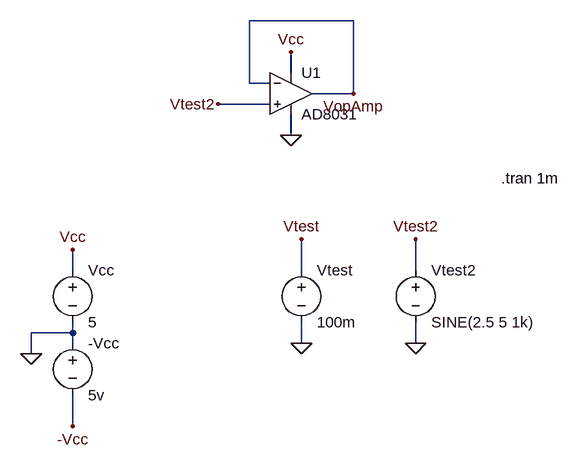
[diagram p0: schematic test_RROpAmp.asc]
test_RROpAmp.asc, the LTspice schematic file:
Version 4
SHEET 1 880 680
WIRE 448 -144 288 -144
WIRE 352 -64 352 -96
WIRE 288 -48 288 -144
WIRE 320 -48 288 -48
WIRE 448 -32 448 -144
WIRE 448 -32 384 -32
WIRE 320 -16 240 -16
WIRE 352 32 352 0
WIRE 16 240 16 208
WIRE 368 240 368 192
WIRE 544 240 544 192
WIRE 16 336 16 320
WIRE 16 336 -48 336
WIRE 16 352 16 336
WIRE 368 352 368 320
WIRE 544 352 544 320
WIRE -48 368 -48 336
WIRE 16 480 16 432
FLAG 16 208 Vcc
FLAG 16 480 -Vcc
FLAG -48 368 0
FLAG 368 352 0
FLAG 544 352 0
FLAG 368 192 Vtest
FLAG 544 192 Vtest2
FLAG 352 -96 Vcc
FLAG 352 32 0
FLAG 448 -32 VopAmp
FLAG 240 -16 Vtest2
SYMBOL voltage 16 224 R0
WINDOW 123 0 0 Left 0
WINDOW 39 0 0 Left 0
SYMATTR InstName Vcc
SYMATTR Value 5
SYMBOL voltage 16 336 R0
WINDOW 123 0 0 Left 0
WINDOW 39 0 0 Left 0
SYMATTR InstName -Vcc
SYMATTR Value 5v
SYMBOL voltage 368 224 R0
WINDOW 123 0 0 Left 0
WINDOW 39 0 0 Left 0
SYMATTR InstName Vtest
SYMATTR Value 100m
SYMBOL voltage 544 224 R0
WINDOW 123 0 0 Left 0
WINDOW 39 0 0 Left 0
SYMATTR InstName Vtest2
SYMATTR Value SINE(2.5 5 1k)
SYMBOL OpAmps\\AD8031 352 -96 R0
SYMATTR InstName U1
TEXT 676 98 Left 2 !.tran 1m

The netlist it stands for:
* test_RROpAmp.asc
Vcc Vcc 0 5
V§-Vcc 0 -Vcc 5v
Vtest Vtest 0 100m
Vtest2 Vtest2 0 SINE(2.5 5 1k)
XU1 Vtest2 VopAmp Vcc 0 VopAmp AD8031  ; pins In+ In- V+ V- OUT
.tran 1m
.backanno
.end

* Results of the author's LTspice run, read from the files saved beside the schematic
* Operating Point, zero values left out:
*   V(vcc) = 5 V
*   V(-vcc) = -5 V
*   V(vtest) = 100 mV
*   V(vtest2) = 2.5 V
*   V(vopamp) = 2.5 V
*   I(Vtest2) = 450 nA
*   I(Vcc) = -1.041 mA
*   Ix(u1:1) = -450 nA
*   Ix(u1:2) = -450 nA
*   Ix(u1:3) = 1.041 mA
*   Ix(u1:4) = -1.041 mA
*   Ix(u1:5) = 450 nA
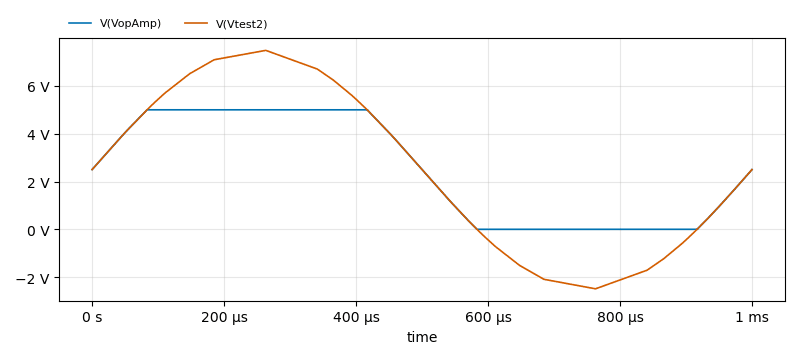
[diagram p1: Transient Analysis of test_RROpAmp.asc, plotted from the saved traces]
* Transient Analysis, 1 run:
*   V(VopAmp): min 2.16 mV, max 4.998 V, average 2.5 V, rms 3.341 V, last 2.5 V
*   V(Vtest2): min -2.482 V, max 7.481 V, average 2.5 V, rms 4.301 V, last 2.5 V